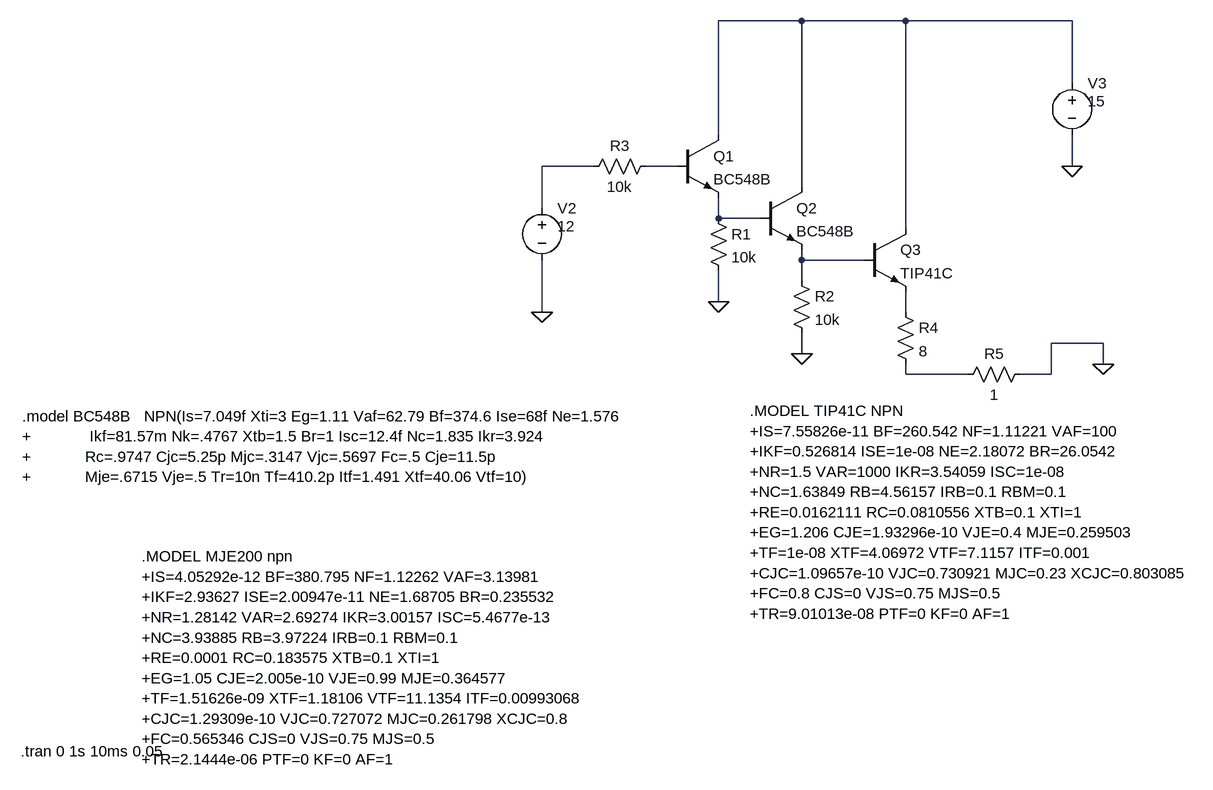
[diagram p0: schematic 2014 q2.asc]
2014 q2.asc, the LTspice schematic file:
Version 4
SHEET 1 2060 680
WIRE 1376 -1328 1248 -1328
WIRE 1536 -1328 1376 -1328
WIRE 1792 -1328 1536 -1328
WIRE 1792 -1232 1792 -1328
WIRE 1248 -1152 1248 -1328
WIRE 1056 -1104 976 -1104
WIRE 1184 -1104 1136 -1104
WIRE 1792 -1104 1792 -1152
WIRE 1376 -1072 1376 -1328
WIRE 976 -1040 976 -1104
WIRE 1248 -1024 1248 -1056
WIRE 1312 -1024 1248 -1024
WIRE 1536 -1008 1536 -1328
WIRE 1376 -960 1376 -976
WIRE 1472 -960 1376 -960
WIRE 1376 -928 1376 -960
WIRE 1248 -896 1248 -944
WIRE 976 -880 976 -960
WIRE 1536 -880 1536 -912
WIRE 1840 -832 1760 -832
WIRE 1376 -816 1376 -848
WIRE 1840 -800 1840 -832
WIRE 1536 -784 1536 -800
WIRE 1632 -784 1536 -784
WIRE 1760 -784 1760 -832
WIRE 1760 -784 1712 -784
FLAG 1248 -896 0
FLAG 976 -880 0
FLAG 1792 -1104 0
FLAG 1376 -816 0
FLAG 1840 -800 0
SYMBOL npn 1184 -1152 R0
SYMATTR InstName Q1
SYMATTR Value BC548B
SYMBOL res 1232 -1040 R0
SYMATTR InstName R1
SYMATTR Value 10k
SYMATTR SpiceLine pwr=10
SYMBOL voltage 976 -1056 R0
WINDOW 3 24 44 Left 2
WINDOW 123 0 0 Left 2
WINDOW 39 0 0 Left 2
SYMATTR Value 12
SYMATTR InstName V2
SYMBOL voltage 1792 -1248 R0
WINDOW 3 24 44 Left 2
WINDOW 123 0 0 Left 2
WINDOW 39 0 0 Left 2
SYMATTR Value 15
SYMATTR InstName V3
SYMBOL res 1360 -944 R0
SYMATTR InstName R2
SYMATTR Value 10k
SYMATTR SpiceLine pwr=10
SYMBOL res 1040 -1088 R270
WINDOW 0 32 56 VTop 2
WINDOW 3 0 56 VBottom 2
SYMATTR InstName R3
SYMATTR Value 10k
SYMBOL npn 1312 -1072 R0
SYMATTR InstName Q2
SYMATTR Value BC548B
SYMBOL npn 1472 -1008 R0
SYMATTR InstName Q3
SYMATTR Value TIP41C
SYMBOL res 1520 -896 R0
SYMATTR InstName R4
SYMATTR Value 8
SYMATTR SpiceLine pwr=10
SYMBOL res 1616 -768 R270
WINDOW 0 32 56 VTop 2
WINDOW 3 0 56 VBottom 2
SYMATTR InstName R5
SYMATTR Value 1
SYMATTR SpiceLine pwr=10
TEXT 176 -720 Left 2 !.model BC548B   NPN(Is=7.049f Xti=3 Eg=1.11 Vaf=62.79 Bf=374.6 Ise=68f Ne=1.576\n+             Ikf=81.57m Nk=.4767 Xtb=1.5 Br=1 Isc=12.4f Nc=1.835 Ikr=3.924\n+            Rc=.9747 Cjc=5.25p Mjc=.3147 Vjc=.5697 Fc=.5 Cje=11.5p\n+            Mje=.6715 Vje=.5 Tr=10n Tf=410.2p Itf=1.491 Xtf=40.06 Vtf=10)
TEXT 360 -504 Left 2 !.MODEL MJE200 npn\n+IS=4.05292e-12 BF=380.795 NF=1.12262 VAF=3.13981\n+IKF=2.93627 ISE=2.00947e-11 NE=1.68705 BR=0.235532\n+NR=1.28142 VAR=2.69274 IKR=3.00157 ISC=5.4677e-13\n+NC=3.93885 RB=3.97224 IRB=0.1 RBM=0.1\n+RE=0.0001 RC=0.183575 XTB=0.1 XTI=1\n+EG=1.05 CJE=2.005e-10 VJE=0.99 MJE=0.364577\n+TF=1.51626e-09 XTF=1.18106 VTF=11.1354 ITF=0.00993068\n+CJC=1.29309e-10 VJC=0.727072 MJC=0.261798 XCJC=0.8\n+FC=0.565346 CJS=0 VJS=0.75 MJS=0.5\n+TR=2.1444e-06 PTF=0 KF=0 AF=1
TEXT 1296 -728 Left 2 !.MODEL TIP41C NPN\n+IS=7.55826e-11 BF=260.542 NF=1.11221 VAF=100\n+IKF=0.526814 ISE=1e-08 NE=2.18072 BR=26.0542\n+NR=1.5 VAR=1000 IKR=3.54059 ISC=1e-08\n+NC=1.63849 RB=4.56157 IRB=0.1 RBM=0.1\n+RE=0.0162111 RC=0.0810556 XTB=0.1 XTI=1\n+EG=1.206 CJE=1.93296e-10 VJE=0.4 MJE=0.259503\n+TF=1e-08 XTF=4.06972 VTF=7.1157 ITF=0.001\n+CJC=1.09657e-10 VJC=0.730921 MJC=0.23 XCJC=0.803085\n+FC=0.8 CJS=0 VJS=0.75 MJS=0.5\n+TR=9.01013e-08 PTF=0 KF=0 AF=1
TEXT 174 -204 Left 2 !.tran 0 1s 10ms 0.05

The netlist it stands for:
* 2014 q2.asc
Q1 N001 N003 N004 0 BC548B
R1 N004 0 10k pwr=10
V2 N002 0 12
V3 N001 0 15
R2 N005 0 10k pwr=10
R3 N002 N003 10k
Q2 N001 N004 N005 0 BC548B
Q3 N001 N005 N006 0 TIP41C
R4 N006 N007 8 pwr=10
R5 N007 0 1 pwr=10
.model NPN NPN
.model PNP PNP
.lib standard.bjt
.model BC548B   NPN(Is=7.049f Xti=3 Eg=1.11 Vaf=62.79 Bf=374.6 Ise=68f Ne=1.576
+             Ikf=81.57m Nk=.4767 Xtb=1.5 Br=1 Isc=12.4f Nc=1.835 Ikr=3.924
+            Rc=.9747 Cjc=5.25p Mjc=.3147 Vjc=.5697 Fc=.5 Cje=11.5p
+            Mje=.6715 Vje=.5 Tr=10n Tf=410.2p Itf=1.491 Xtf=40.06 Vtf=10)
.MODEL MJE200 npn
+IS=4.05292e-12 BF=380.795 NF=1.12262 VAF=3.13981
+IKF=2.93627 ISE=2.00947e-11 NE=1.68705 BR=0.235532
+NR=1.28142 VAR=2.69274 IKR=3.00157 ISC=5.4677e-13
+NC=3.93885 RB=3.97224 IRB=0.1 RBM=0.1
+RE=0.0001 RC=0.183575 XTB=0.1 XTI=1
+EG=1.05 CJE=2.005e-10 VJE=0.99 MJE=0.364577
+TF=1.51626e-09 XTF=1.18106 VTF=11.1354 ITF=0.00993068
+CJC=1.29309e-10 VJC=0.727072 MJC=0.261798 XCJC=0.8
+FC=0.565346 CJS=0 VJS=0.75 MJS=0.5
+TR=2.1444e-06 PTF=0 KF=0 AF=1
.MODEL TIP41C NPN
+IS=7.55826e-11 BF=260.542 NF=1.11221 VAF=100
+IKF=0.526814 ISE=1e-08 NE=2.18072 BR=26.0542
+NR=1.5 VAR=1000 IKR=3.54059 ISC=1e-08
+NC=1.63849 RB=4.56157 IRB=0.1 RBM=0.1
+RE=0.0162111 RC=0.0810556 XTB=0.1 XTI=1
+EG=1.206 CJE=1.93296e-10 VJE=0.4 MJE=0.259503
+TF=1e-08 XTF=4.06972 VTF=7.1157 ITF=0.001
+CJC=1.09657e-10 VJC=0.730921 MJC=0.23 XCJC=0.803085
+FC=0.8 CJS=0 VJS=0.75 MJS=0.5
+TR=9.01013e-08 PTF=0 KF=0 AF=1
.tran 0 1s 10ms 0.05
.backanno
.end